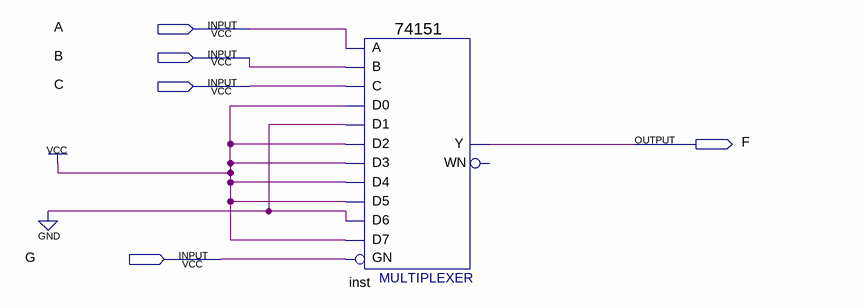
[diagram p0: schematic sheet]
// Quartus schematic w4_1.bdf as structural Verilog: 1 symbols, 5 pins
module w4_1 (
  input  A,
  input  B,
  input  C,
  input  G,
  output F
);

  \74151  inst (
    .GN(G), .C(C), .B(B), .A(A), .D5(1'b1), .D0(1'b1), .D1(1'b0), .D4(1'b1), .D3(1'b1), .D2(1'b1), .D6(1'b0),
    .D7(1'b1), .Y(F));  // open: WN
endmodule
